# EAGLE design lul (EAGLE 9.5.1)
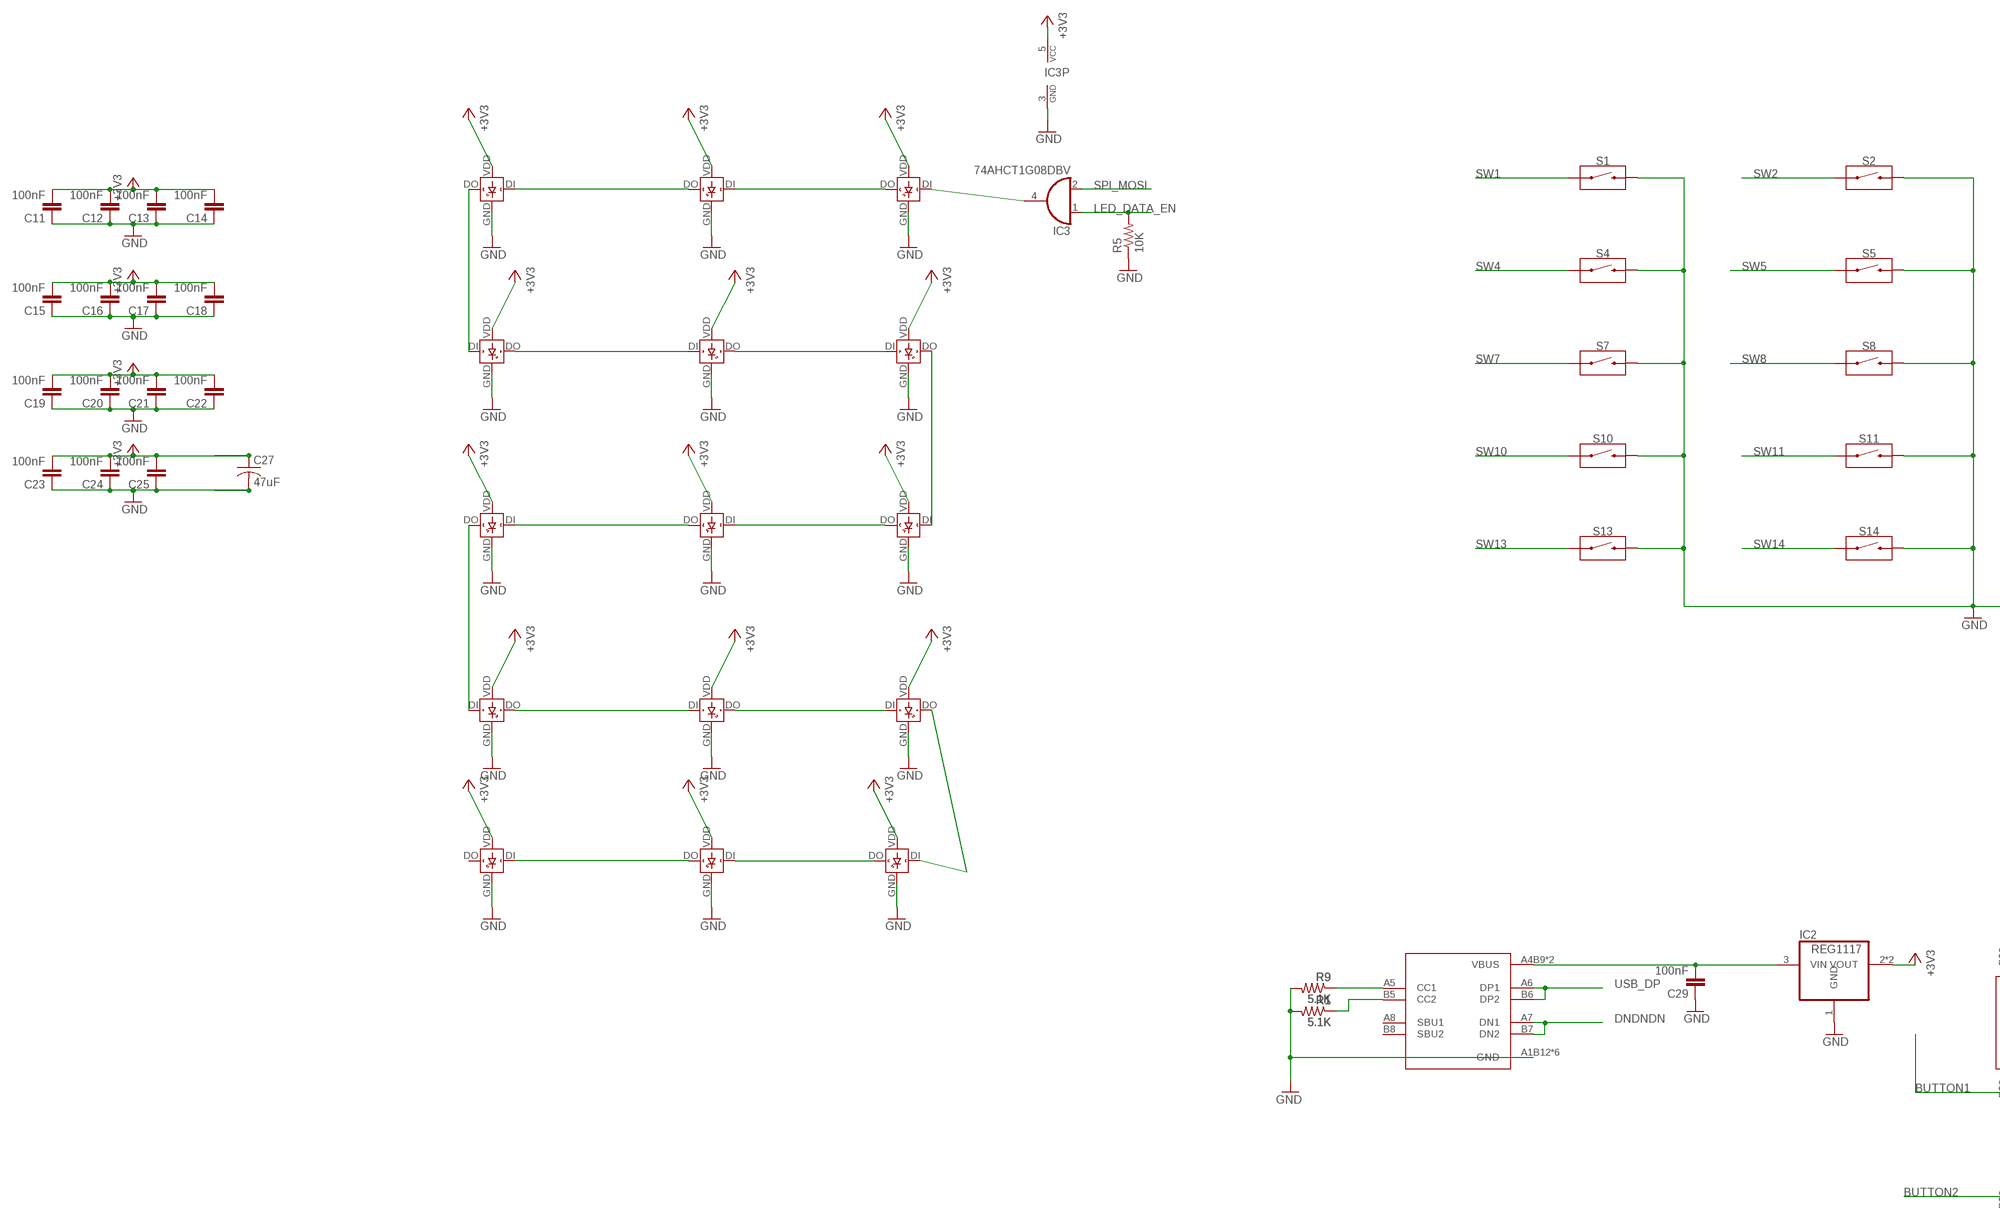
[diagram p0: schematic, sheet 1, part 1 of 2]
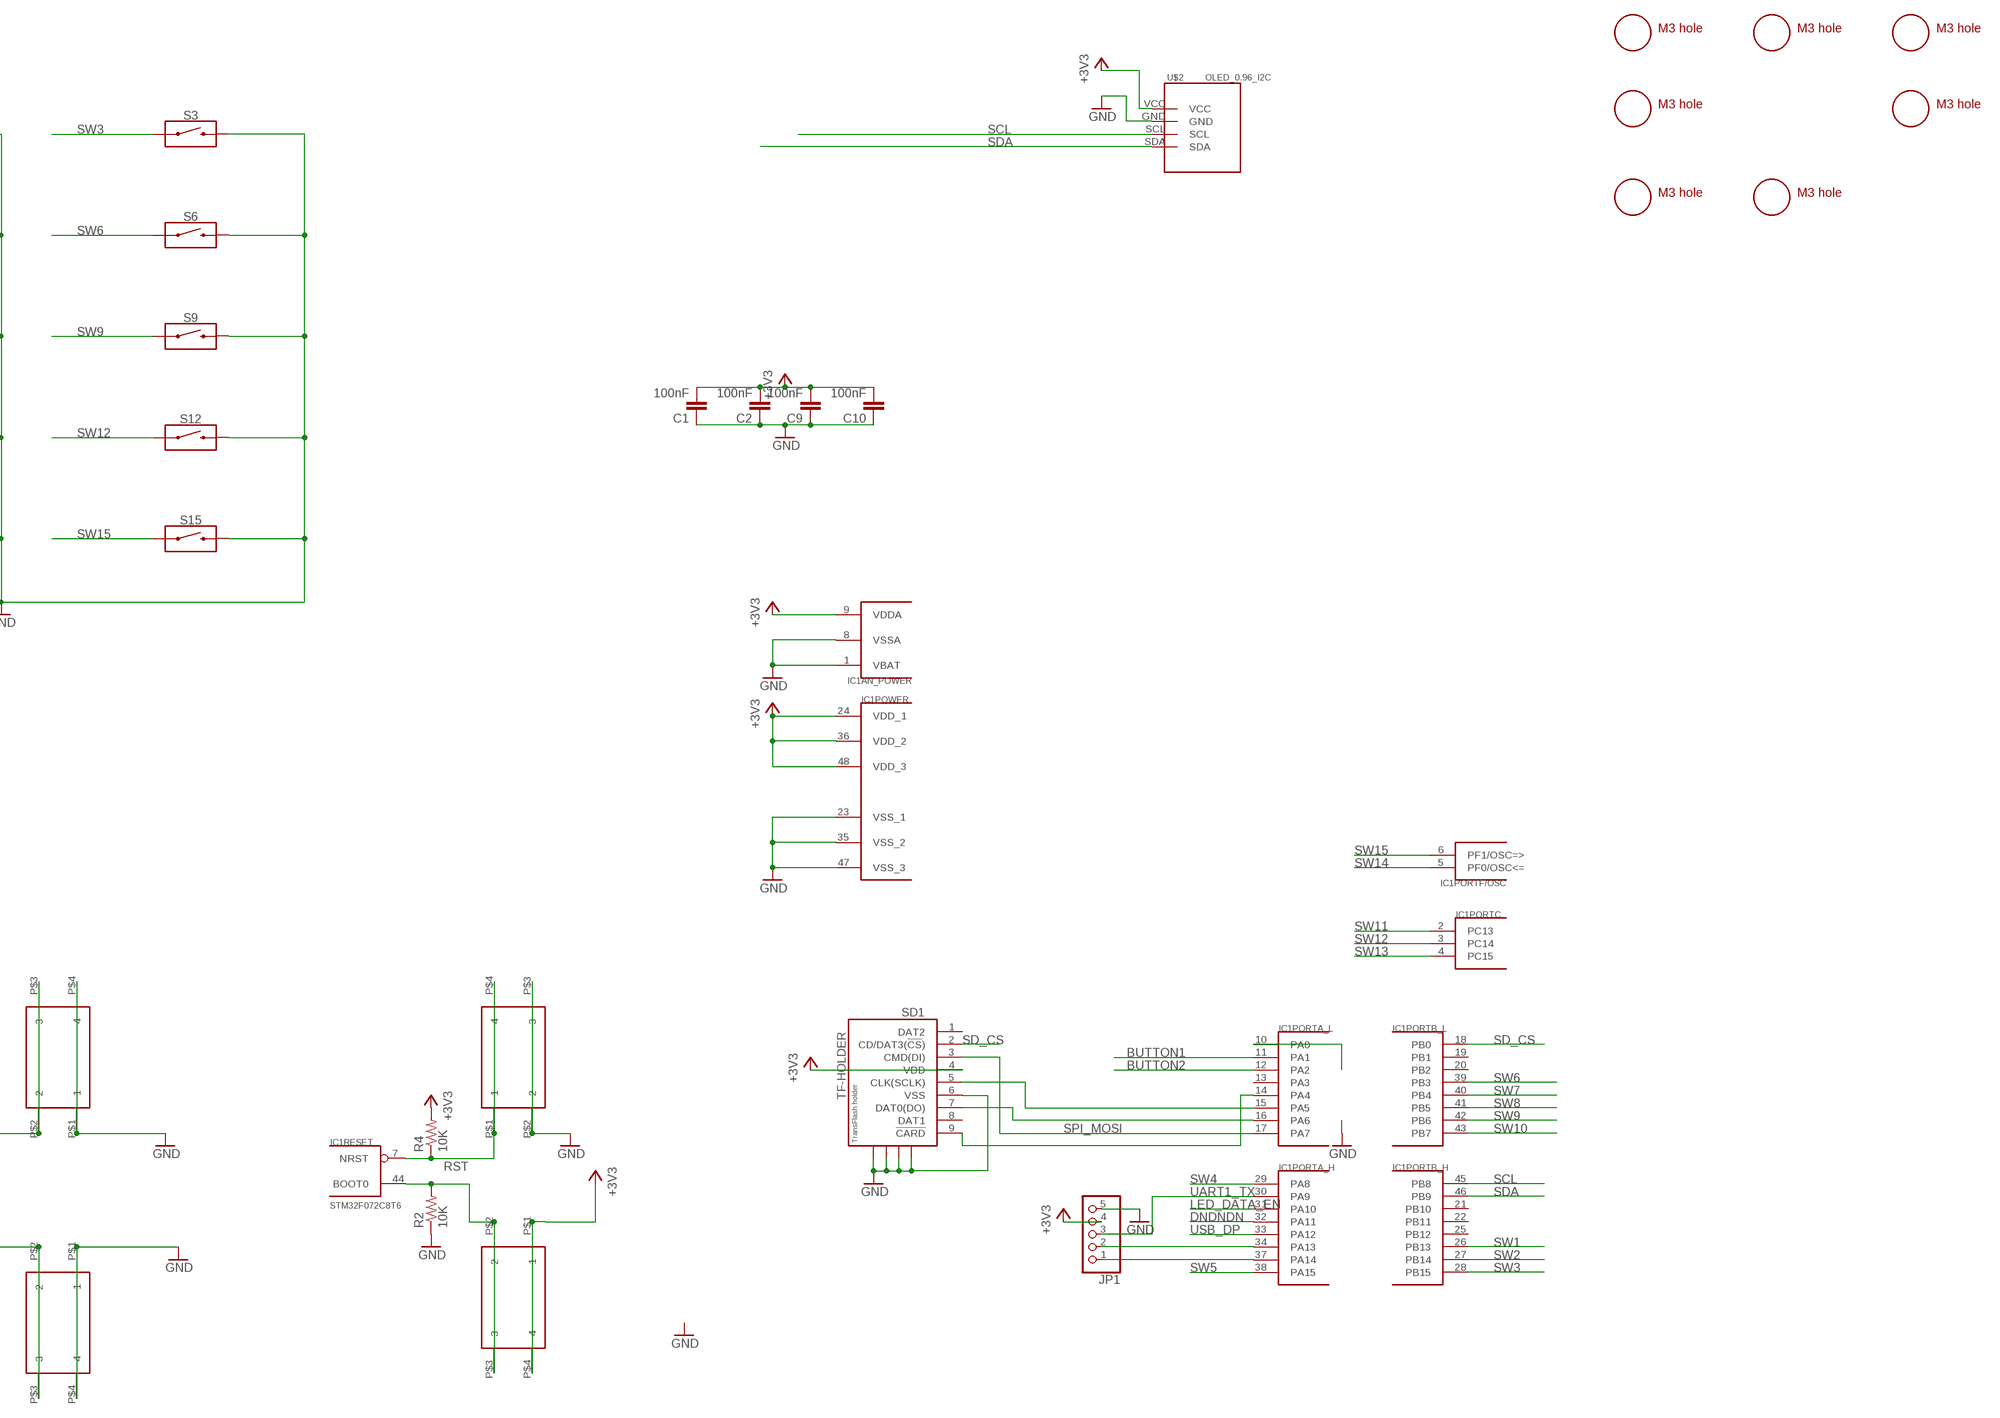
[diagram p1: schematic, sheet 1, part 2 of 2]

## Parts
C1  100nF  CAP0805  [0805@1]
C2  100nF  CAP0805  [0805@1]
C9  100nF  CAP0805  [0805@1]
C10  100nF  CAP0805  [0805@1]
C11  100nF  CAP0805  [0805@1]
C12  100nF  CAP0805  [0805@1]
C13  100nF  CAP0805  [0805@1]
C14  100nF  CAP0805  [0805@1]
C15  100nF  CAP0805  [0805@1]
C16  100nF  CAP0805  [0805@1]
C17  100nF  CAP0805  [0805@1]
C18  100nF  CAP0805  [0805@1]
C19  100nF  CAP0805  [0805@1]
C20  100nF  CAP0805  [0805@1]
C21  100nF  CAP0805  [0805@1]
C22  100nF  CAP0805  [0805@1]
C23  100nF  CAP0805  [0805@1]
C24  100nF  CAP0805  [0805@1]
C25  100nF  CAP0805  [0805@1]
C27  47uF  C-USC1210  [C1210]
C29  100nF  CAP0805  [0805@1]
IC1  STM32F072C8T6  [TQFP48]
IC2  REG1117  [SOT223]
IC3  74AHCT1G08DBV  [SOT23-5]
JP1  PINHD-1X5  [1X05]
LED1  WS2812B-MINI  [WS2812B-MINI]
LED2  WS2812B-MINI  [WS2812B-MINI]
LED3  WS2812B-MINI  [WS2812B-MINI]
LED4  WS2812B-MINI  [WS2812B-MINI]
LED5  WS2812B-MINI  [WS2812B-MINI]
LED6  WS2812B-MINI  [WS2812B-MINI]
LED7  WS2812B-MINI  [WS2812B-MINI]
LED8  WS2812B-MINI  [WS2812B-MINI]
LED9  WS2812B-MINI  [WS2812B-MINI]
LED10  WS2812B-MINI  [WS2812B-MINI]
LED11  WS2812B-MINI  [WS2812B-MINI]
LED12  WS2812B-MINI  [WS2812B-MINI]
LED13  WS2812B-MINI  [WS2812B-MINI]
LED14  WS2812B-MINI  [WS2812B-MINI]
LED15  WS2812B-MINI  [WS2812B-MINI]
R1  5.1K  RESISTOR0805-RES  [0805]
R2  10K  RESISTOR0805-RES  [0805]
R4  10K  RESISTOR0805-RES  [0805]
R5  10K  RESISTOR0805-RES  [0805]
R9  5.1K  RESISTOR0805-RES  [0805]
S1  CHERRY-MX-LED  [CHERRY-MX-LED]
S2  CHERRY-MX-LED  [CHERRY-MX-LED]
S3  CHERRY-MX-LED  [CHERRY-MX-LED]
S4  CHERRY-MX-LED  [CHERRY-MX-LED]
S5  CHERRY-MX-LED  [CHERRY-MX-LED]
S6  CHERRY-MX-LED  [CHERRY-MX-LED]
S7  CHERRY-MX-LED  [CHERRY-MX-LED]
S8  CHERRY-MX-LED  [CHERRY-MX-LED]
S9  CHERRY-MX-LED  [CHERRY-MX-LED]
S10  CHERRY-MX-LED  [CHERRY-MX-LED]
S11  CHERRY-MX-LED  [CHERRY-MX-LED]
S12  CHERRY-MX-LED  [CHERRY-MX-LED]
S13  CHERRY-MX-LED  [CHERRY-MX-LED]
S14  CHERRY-MX-LED  [CHERRY-MX-LED]
S15  CHERRY-MX-LED  [CHERRY-MX-LED]
SD1  TF-HOLDER  [TF-PULL]
SW1  324_SW324_SWITCH_FOOT_HOLE  [342_SWICH_FOOT_HOLE]
SW2  324_SW324_SWITCH_FOOT_HOLE  [342_SWICH_FOOT_HOLE]
SW3  324_SW324_SWITCH_FOOT_HOLE  [342_SWICH_FOOT_HOLE]
SW4  324_SW324_SWITCH_FOOT_HOLE  [342_SWICH_FOOT_HOLE]
U2  USBC_16P  [USBC_16P_FOOT]
U$2  OLED_0.96_I2C  [OLED_0.96_I2C]
U$7  M3_MOUNTING_HOLE  [M3_MOUNTING_HOLE_PACK]
U$9  M3_MOUNTING_HOLE  [M3_MOUNTING_HOLE_PACK]
U$10  M3_MOUNTING_HOLE  [M3_MOUNTING_HOLE_PACK]
U$11  M3_MOUNTING_HOLE  [M3_MOUNTING_HOLE_PACK]
U$14  M3_MOUNTING_HOLE  [M3_MOUNTING_HOLE_PACK]
U$15  M3_MOUNTING_HOLE  [M3_MOUNTING_HOLE_PACK]
U$16  M3_MOUNTING_HOLE  [M3_MOUNTING_HOLE_PACK]

## Nets
+3V3: C1.2 C2.2 C9.2 C10.2 C11.2 C12.2 C13.2 C14.2 C15.2 C16.2 C17.2 C18.2 C19.2 C20.2 C21.2 C22.2 C23.2 C24.2 C25.2 C27.1 IC1.9(AN_POWER:VDDA) IC1.24(POWER:VDD_1) IC1.36(POWER:VDD_2) IC1.48(POWER:VDD_3) IC2.2(VOUT) IC2.4(VOUT) IC3.5(VCC) JP1.4 LED1.VDD LED2.VDD LED3.VDD LED4.VDD LED5.VDD LED6.VDD LED7.VDD LED8.VDD LED9.VDD LED10.VDD LED11.VDD LED12.VDD LED13.VDD LED14.VDD LED15.VDD R4.2 SD1.4(VDD) SW1.P$1 SW1.P$4 U$2.VCC
BUTTON1: IC1.11(PORTA_L:PA1) SW3.P$2 SW3.P$3
BUTTON2: IC1.12(PORTA_L:PA2) SW4.P$2 SW4.P$3
DNDNDN: IC1.32(PORTA_H:PA11) U2.A7(DN1) U2.B7(DN2)
GND: C1.1 C2.1 C9.1 C10.1 C11.1 C12.1 C13.1 C14.1 C15.1 C16.1 C17.1 C18.1 C19.1 C20.1 C21.1 C22.1 C23.1 C24.1 C25.1 C27.2 C29.1 IC1.1(AN_POWER:VBAT) IC1.8(AN_POWER:VSSA) IC1.23(POWER:VSS_1) IC1.35(POWER:VSS_2) IC1.47(POWER:VSS_3) IC2.1(GND) IC3.3(GND) JP1.5 LED1.GND LED2.GND LED3.GND LED4.GND LED5.GND LED6.GND LED7.GND LED8.GND LED9.GND LED10.GND LED11.GND LED12.GND LED13.GND LED14.GND LED15.GND R1.2 R2.1 R5.1 R9.2 S1.S2 S2.S2 S3.S2 S4.S2 S5.S2 S6.S2 S7.S2 S8.S2 S9.S2 S10.S2 S11.S2 S12.S2 S13.S2 S14.S2 S15.S2 SD1.6(VSS) SD1.S1 SD1.S2 SD1.S3 SD1.S4 SW2.P$2 SW2.P$3 SW3.P$1 SW3.P$4 SW4.P$1 SW4.P$4 U2.A1B12(GND) U2.B11A12(GND) U2.P$13(GND) U2.P$14(GND) U2.P$15(GND) U2.P$16(GND) U$2.GND
LED_DATA_EN: IC1.31(PORTA_H:PA10) IC3.1(I0) R5.2
N$1: C29.2 IC2.3(VIN) U2.A4B9(VBUS) U2.B4A9(VBUS)
N$2: IC1.44(RESET:BOOT0) R2.2 SW1.P$2 SW1.P$3
N$8: IC1.15(PORTA_L:PA5) SD1.5(CLK(SCLK))
N$9: LED2.DI(DIN) LED3.DO(DOUT)
N$10: IC1.16(PORTA_L:PA6) SD1.7(DAT0(DO))
N$14: IC1.14(PORTA_L:PA4) SD1.9(!CARD)
N$15: LED1.DI(DIN) LED2.DO(DOUT)
N$17: LED1.DO(DOUT) LED4.DI(DIN)
N$18: LED4.DO(DOUT) LED5.DI(DIN)
N$19: LED5.DO(DOUT) LED6.DI(DIN)
N$20: LED6.DO(DOUT) LED9.DI(DIN)
N$21: LED8.DI(DIN) LED9.DO(DOUT)
N$22: LED7.DI(DIN) LED8.DO(DOUT)
N$23: LED7.DO(DOUT) LED10.DI(DIN)
N$24: LED10.DO(DOUT) LED11.DI(DIN)
N$25: LED11.DO(DOUT) LED12.DI(DIN)
N$26: LED12.DO(DOUT) LED15.DI(DIN)
N$27: LED14.DI(DIN) LED15.DO(DOUT)
N$28: LED13.DI(DIN) LED14.DO(DOUT)
N$29: IC3.4(O) LED3.DI(DIN)
N$31: R1.1 U2.B5(CC2)
N$32: IC1.37(PORTA_H:PA14) JP1.1
N$33: R9.1 U2.A5(CC1)
N$34: IC1.34(PORTA_H:PA13) JP1.2
OLED_RESET: IC1.10(PORTA_L:PA0)
RST: IC1.7(RESET:NRST) R4.1 SW2.P$1 SW2.P$4
SCL: IC1.45(PORTB_H:PB8) U$2.SCL
SD_CS: IC1.18(PORTB_L:PB0) SD1.2(CD/DAT3(!CS!))
SDA: IC1.46(PORTB_H:PB9) U$2.SDA
SPI_MOSI: IC1.17(PORTA_L:PA7) IC3.2(I1) SD1.3(CMD(DI))
SW1: IC1.26(PORTB_H:PB13) S1.S1
SW2: IC1.27(PORTB_H:PB14) S2.S1
SW3: IC1.28(PORTB_H:PB15) S3.S1
SW4: IC1.29(PORTA_H:PA8) S4.S1
SW5: IC1.38(PORTA_H:PA15) S5.S1
SW6: IC1.39(PORTB_L:PB3) S6.S1
SW7: IC1.40(PORTB_L:PB4) S7.S1
SW8: IC1.41(PORTB_L:PB5) S8.S1
SW9: IC1.42(PORTB_L:PB6) S9.S1
SW10: IC1.43(PORTB_L:PB7) S10.S1
SW11: IC1.2(PORTC:PC13) S11.S1
SW12: IC1.3(PORTC:PC14) S12.S1
SW13: IC1.4(PORTC:PC15) S13.S1
SW14: IC1.5(PORTF/OSC:PF0/OSC<=) S14.S1
SW15: IC1.6(PORTF/OSC:PF1/OSC=>) S15.S1
UART1_TX: IC1.30(PORTA_H:PA9) JP1.3
USB_DP: IC1.33(PORTA_H:PA12) U2.A6(DP1) U2.B6(DP2)
Unconnected: IC1.13(PORTA_L:PA3) IC1.19(PORTB_L:PB1) IC1.20(PORTB_L:PB2) IC1.21(PORTB_H:PB10) IC1.22(PORTB_H:PB11) IC1.25(PORTB_H:PB12) LED13.DO(DOUT) SD1.1(DAT2) SD1.8(DAT1) U2.A8(SBU1) U2.B8(SBU2)

## Library data of the parts
C1 C2 C9-C25 C29 = clock:CAP: Capacitor Standard 0603 ceramic capacitor, and 0.1" leaded capacitor.
C27 = clock:C-US: CAPACITOR, American symbol
IC1 = clock:STM32F072C8T6: ST STM32F072 48pin LQFP
IC2 = clock:REG1117: 800mA and 1A Low Dropout (LDO) Positive Regulator 1.8V, 2.5V, 2.85V, 3.3V, 5V, and Adj; MPN: REG1117; OC_FARNELL: 1097566; OC_NEWARK: 14P6981
IC3 = 74xx-little-de:74*1G08: 2-input AND gate
JP1 = pinhead:PINHD-1X5: PIN HEADER
LED1-LED15 = LED:WS2812B
R1 R9 = joyAnalog:RESISTOR: Resistor Basic schematic elements and footprints for 0603, 1206, and PTH resistors.
R2 R4 R5 = clock:RESISTOR: Resistor Basic schematic elements and footprints for 0603, 1206, and PTH resistors.
S1-S15 = SparkFun-Cherry-MX-Switch-Breakout:CHERRY-MX-LED
SD1 = clock:TF-HOLDER: TF / Micro SD socket is PUSH-PUSH type, the card can be pushed into and auto locked and pushed out by simply press the card. Surface Mounting type.
SW1-SW4 = 3pos_slide_switch:324_SW
U2 = my_usbc_16p:USBC_16P
U$2 = tft_1.8_1.44_oled_0.96:OLED_0.96_I2C
U$7 U$9-U$11 U$14-U$16 = clock:M3_MOUNTING_HOLE

## Board
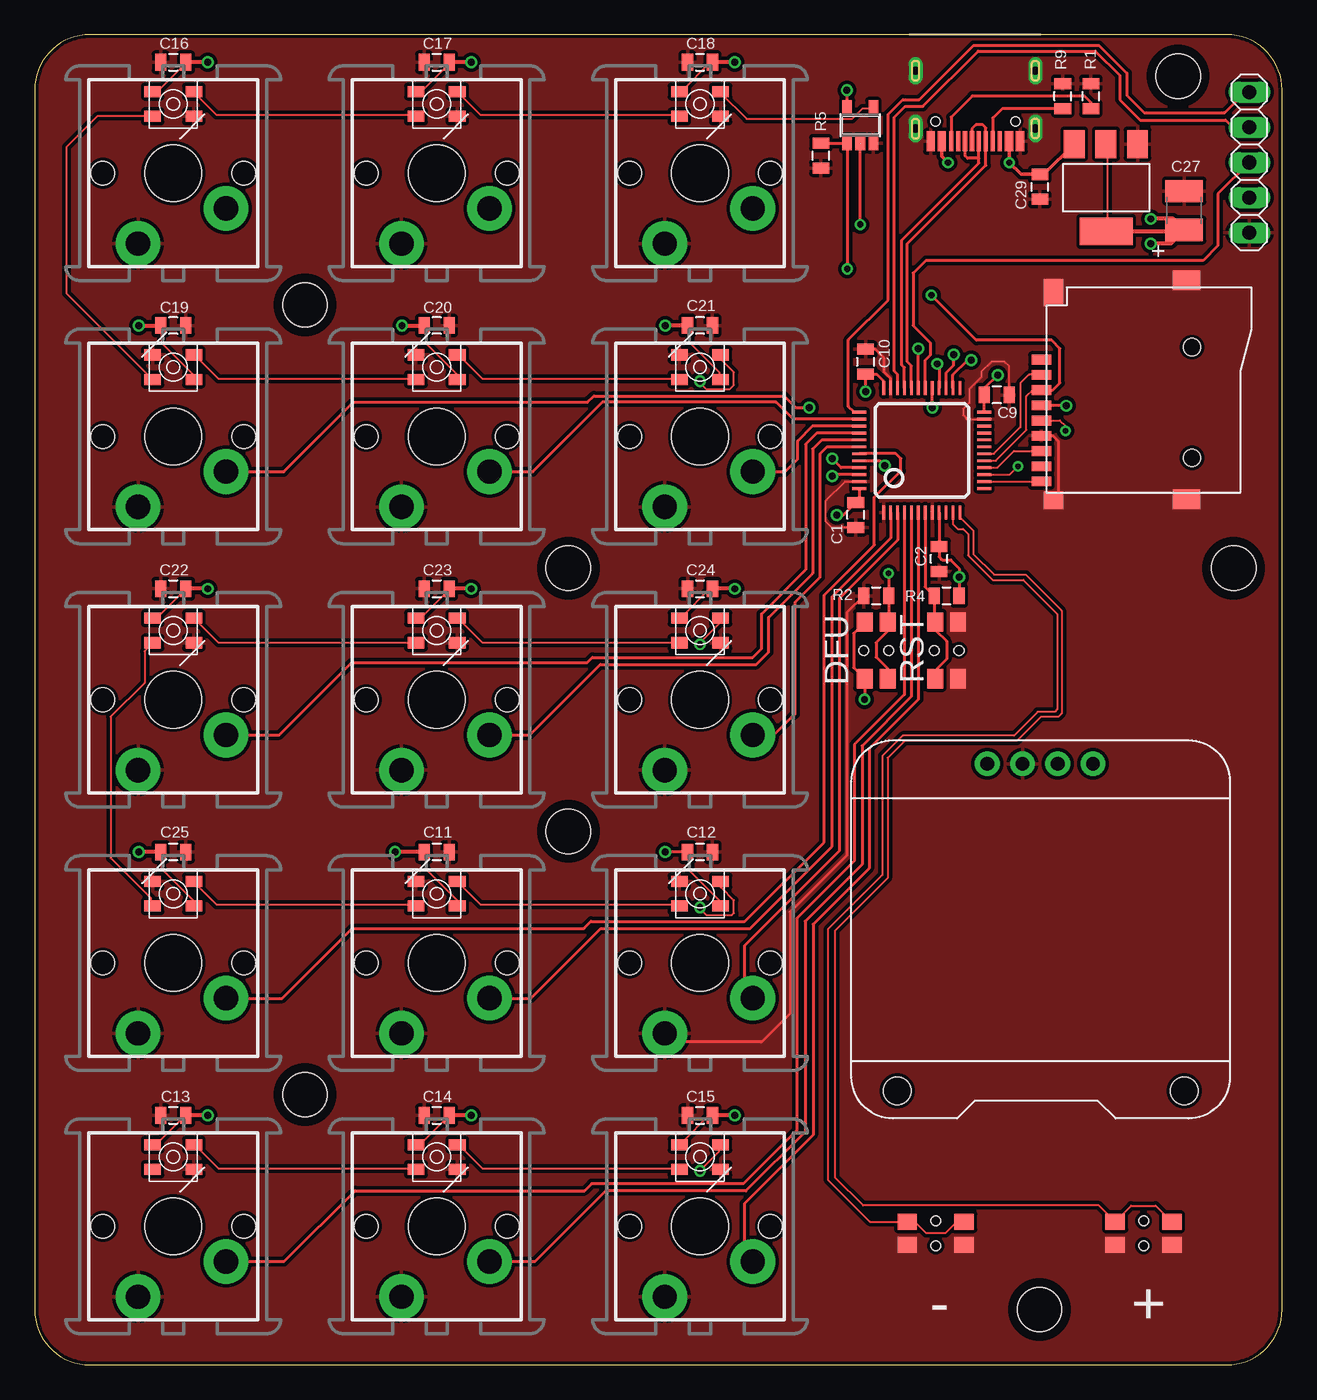
[diagram p2: board, top side]
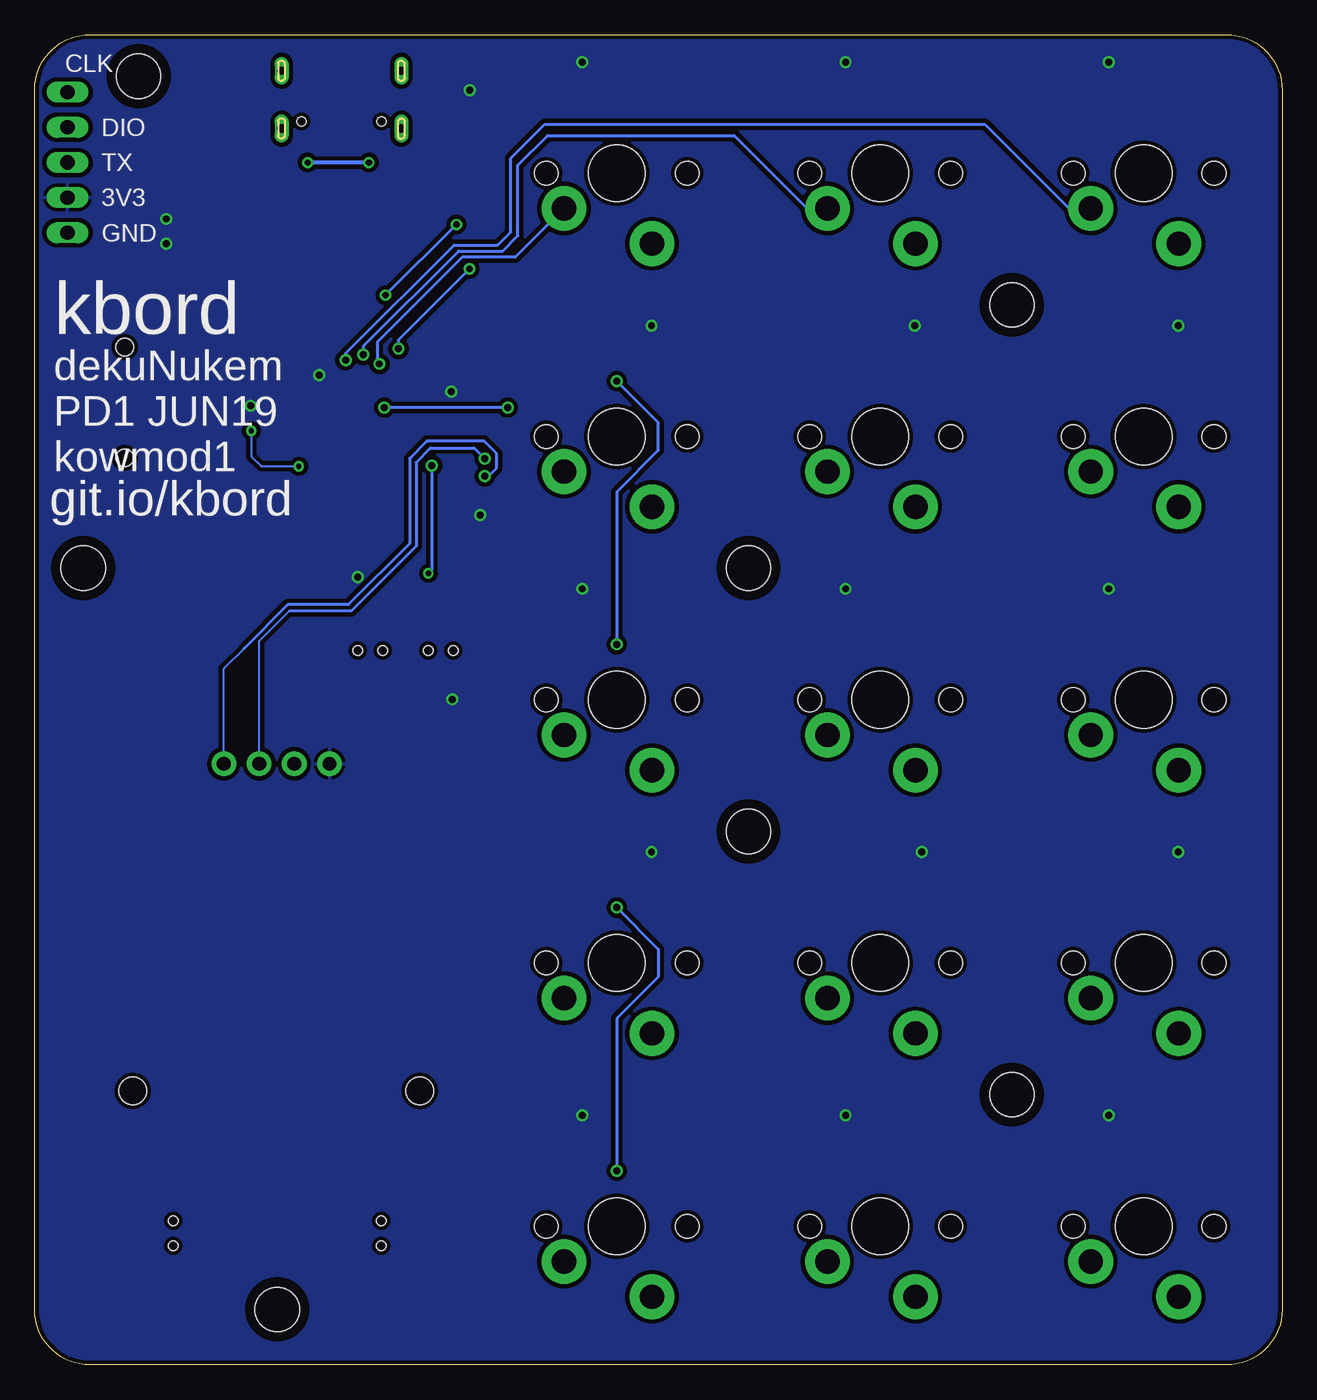
[diagram p3: board, bottom side, seen from below]

Size 90 x 96 mm. Coordinates in mm from the lower left corner, seen from the top.
Outline: 0,92 0,4 arc90 4,0 86,0 arc90 90,4 90,92 arc90 86,96 4,96 arc90 0,92
Copper layers (1*16): Top 0.035mm / dielectric 1.5mm / Bottom 0.035mm
Design rules "deku_2layer_6mil": minimum track width 6mil, minimum drill 15mil, track to track 6mil, track to pad 6mil, pad to pad 6mil, via to via 6mil, smd to smd 6mil, copper to edge 10mil, drill to drill 6mil, minimum pad ring 7mil, minimum via ring 7mil, stop-mask expansion 4mil, vias tented up to drill 25mil, thermal gap 10mil

### Footprints (pad centres in the part's own frame; a part is rotated, then mirrored left to right if it is on the bottom)
0805@1 = smd 0.8 x 1.2: 1 -0.9,0; 2 0.9,0
C1210 = smd 1.6 x 2.7: 1 -1.4,0; 2 1.4,0
TQFP48 = smd 0.2 x 1: 1 -2.75,-4.5; 2 -2.25,-4.5; 3 -1.75,-4.5; 4 -1.25,-4.5; 5 -0.75,-4.5; 6 -0.25,-4.5; 7 0.25,-4.5; 8 0.75,-4.5; 9 1.25,-4.5; 10 1.75,-4.5; 11 2.25,-4.5; 12 2.75,-4.5; 25 2.75,4.5; 26 2.25,4.5; 27 1.75,4.5; 28 1.25,4.5; 29 0.75,4.5; 30 0.25,4.5; 31 -0.25,4.5; 32 -0.75,4.5; 33 -1.25,4.5; 34 -1.75,4.5; 35 -2.25,4.5; 36 -2.75,4.5 | smd 1 x 0.2: 13 4.5,-2.75; 14 4.5,-2.25; 15 4.5,-1.75; 16 4.5,-1.25; 17 4.5,-0.75; 18 4.5,-0.25; 19 4.5,0.25; 20 4.5,0.75; 21 4.5,1.25; 22 4.5,1.75; 23 4.5,2.25; 24 4.5,2.75; 37 -4.5,2.75; 38 -4.5,2.25; 39 -4.5,1.75; 40 -4.5,1.25; 41 -4.5,0.75; 42 -4.5,0.25; 43 -4.5,-0.25; 44 -4.5,-0.75; 45 -4.5,-1.25; 46 -4.5,-1.75; 47 -4.5,-2.25; 48 -4.5,-2.75
SOT223 = smd 1.499 x 2.007: 1 -2.261,-3.15; 2 0.025,-3.15; 3 2.311,-3.15 | smd 3.81 x 2.007: 4 0,3.15
SOT23-5 = smd 0.69 x 0.99: 1 -0.95,-1.29; 2 0,-1.29; 3 0.95,-1.29; 4 0.95,1.3; 5 -0.95,1.3
1X05 = drill 1.016 long: 1 -5.08,0; 2 -2.54,0; 3 0,0; 4 2.54,0; 5 5.08,0
WS2812B-MINI = smd 0.8 x 1.2: DI 0.89,-1.49; DO -0.89,1.49; GND -0.89,-1.49; VDD 0.89,1.49
0805 = smd 0.8 x 1.2: 1 -0.9,0; 2 0.9,0
CHERRY-MX-LED = drill 1.753 pad 3.226: S1 -3.81,2.54; S2 2.54,5.08 | hole 4.089: 0,0 | hole 1.707: -5.08,0; 5.08,0
TF-PULL = smd 0.7 x 1.4: 1 -2.2,-7.62; 2 -1.1,-7.62; 3 0,-7.62; 4 1.1,-7.62; 5 2.2,-7.62; 6 3.3,-7.62; 7 4.4,-7.62; 8 5.5,-7.62; 9 6.6,-7.62 | smd 1.4 x 2: S1 -7.9,2.85; S2 7.9,2.85 | smd 1.28 x 1.4: S3 7.96,-6.75 | smd 1.95 x 1.4: S4 -7.025,-6.75 | hole 1.25: -3.1,3.25; 4.9,3.25
342_SWICH_FOOT_HOLE = smd 1.4 x 1.15: P$1 -2.05,-0.825; P$2 -2.05,0.825; P$3 2.05,0.825; P$4 2.05,-0.825 | hole 0.7: 0,0.9; 0,-0.9
USBC_16P_FOOT = smd 0.6 x 1.45: A1B12 -3.225,3.848; A4B9 -2.425,3.848; B4A9 2.425,3.848; B11A12 3.225,3.848 | smd 0.3 x 1.45: A5 -1.25,3.848; A6 -0.25,3.848; A7 0.25,3.848; A8 1.25,3.848; B5 1.75,3.848; B6 0.75,3.848; B7 -0.75,3.848; B8 -1.75,3.848 | drill 0.6 pad 1 long: P$13 -4.32,2.933; P$14 4.32,2.933; P$15 -4.32,-1.248; P$16 4.32,-1.248 | hole 0.65: -2.89,2.402; 2.89,2.402
OLED_0.96_I2C = drill 1 pad 1.778: GND -1.63,11.63; SCL 0.91,11.63; SDA 3.45,11.63; VCC -4.17,11.63 | hole 2: -10.67,-11.97; 10.03,-11.97
M3_MOUNTING_HOLE_PACK = hole 3.2: 0,0

### Placement (x,y rotation side)
C1  59.23,61.34 90 top
C2  65.25,58.17 90 top
C9  69.42,70 180 top
C10  59.94,72.39 270 top
C11  29,37.01 180 top
C12  48,37.01 180 top
C13  10,18.01 0 top
C14  29,18.01 0 top
C15  48,18.01 0 top
C16  10,94.01 0 top
C17  29,94.01 0 top
C18  48,94.01 0 top
C19  10,75.01 180 top
C20  29,75.01 180 top
C21  48,75.01 180 top
C22  10,56.01 0 top
C23  29,56.01 0 top
C24  48,56.01 0 top
C25  10,37.01 180 top
C27  82.93,83.31 90 top
C29  72.52,85.01 90 top
IC1  64,66 0 top
IC2  77.31,84.95 180 top
IC3  59.56,89.46 0 top
JP1  87.63,86.77 270 top
LED1  10,91 90 top
LED2  29,91 90 top
LED3  48,91 90 top
LED4  10,72 270 top
LED5  29,72 270 top
LED6  48,72 270 top
LED7  10,53 90 top
LED8  29,53 90 top
LED9  48,53 90 top
LED10  10,34 270 top
LED11  29,34 270 top
LED12  48,34 270 top
LED13  10,15 90 top
LED14  29,15 90 top
LED15  48,15 90 top
R1  76.2,91.57 90 top
R2  60.71,55.5 0 top
R4  65.79,55.5 0 top
R5  56.72,87.27 90 top
R9  74.17,91.57 90 top
S1  10,86 180 top
S2  29,86 180 top
S3  48,86 180 top
S4  10,67 180 top
S5  29,67 180 top
S6  48,67 180 top
S7  10,48 180 top
S8  29,48 180 top
S9  48,48 180 top
S10  10,29 180 top
S11  29,29 180 top
S12  48,29 180 top
S13  10,10 180 top
S14  29,10 180 top
S15  48,10 180 top
SD1  80.25,70.35 270 top
SW1  60.71,51.56 270 top
SW2  65.79,51.56 270 top
SW3  65,9.5 0 top
SW4  80,9.5 0 top
U2  67.87,92.15 180 top
U$2  72.9,31.75 0 top
U$7  19.5,19.5 0 top
U$9  86.5,57.5 0 top
U$10  82.5,93 0 top
U$11  19.5,76.5 0 top
U$14  72.5,4 0 top
U$15  38.5,57.5 0 top
U$16  38.5,38.5 0 top

### Tracks (layer width: path | path; a pad name or v marks a point on that pad's centre or on a via)
+3V3  (via drill 0.5)
  Top 0.152: LED13.VDD 8.53,16 8.84,16 10.82,17.98 C13.2 | LED14.VDD 27.58,16 27.89,16 29.87,17.98 C14.2 | LED15.VDD 46.63,16 48.77,18.14 C15.2 | LED7.VDD 8.53,53.95 8.84,53.95 10.82,55.93 C22.2 | LED11.VDD 30.48,33.22 30.48,33.53 28.19,35.81 28.19,36.88 C11.2 | LED8.VDD 27.58,53.95 27.89,53.95 29.87,55.93 C23.2 | LED9.VDD 46.63,53.95 48.77,56.08 C24.2 | LED5.VDD 30.48,71.17 30.48,71.48 28.19,73.76 28.19,74.98 C20.2 | LED1.VDD 8.53,91.9 8.84,91.9 10.82,93.88 C16.2 | LED6.VDD 49.38,71.17 49.38,71.63 47.24,73.76 47.24,74.98 C21.2 | LED2.VDD 27.58,91.9 27.89,91.9 29.87,93.88 C17.2 | LED3.VDD 46.63,91.9 48.77,94.03 C18.2 | IC2.2 77.42,88.09 77.42,81.84 IC2.4 | LED10.VDD 11.43,33.22 11.43,33.53 9.14,35.81 9.14,36.88 C25.2 | LED12.VDD 49.38,33.22 49.38,33.53 47.24,35.66 47.24,36.88 C12.2 | C19.2 9.14,74.98 9.14,73.76 11.43,71.48 11.43,71.17 LED4.VDD
  Top 0.203: v59.94,70.23 C10.2 60.77,71.49 61.25,71.01 IC1.36 | SD1.4 74.38,69.25 v74.42,69.22 | C12.2 v45.5,37.01 | IC3.5 58.61,91.99 v58.6,92 | v69.47,71.42 68.52,70.47 C9.2 68.5,69.98 IC1.24 | v57.86,61.34 58.33,61.34 C1.2 59.5,62.51 IC1.48 | SW1.P$1 59.88,53.58 59.08,52.78 59.08,50.32 SW1.P$4 59.88,48.05 v59.87,48.03 | IC1.9 C2.2 65.25,58.32 65.48,58.09 66.09,58.09 66.7,57.48 v66.7,56.84 66.7,55.51 R4.2
  Top 0.305: v12.5,18.01 C13.2 | v31.5,18.01 C14.2 | v50.5,18.01 C15.2 | v7.5,75.01 C19.2 | v26.5,75.01 C20.2 | C21.2 v45.5,75.01 | C25.2 v7.5,37.01 | C11.2 v26,37.01 | v12.5,94.01 C16.2 | v31.5,94.01 C17.2 | v50.5,94.01 C18.2 | v12.5,56.01 C22.2 | v31.5,56.01 C23.2 | v50.5,56.01 C24.2 | IC2.4 82.82,81.81 | 82.82,81.81 C27.1 82.14,82.7 v80.52,82.7 | v80.52,80.92 81.94,80.92 82.82,81.81
  pour Bottom (isolate 0.305): 0,96.01 0,0 90.04,0 90.04,96.01
BUTTON1
  Top 0.152: IC1.11 66.25,60.67 66.6,60.33 66.98,60.33 67.33,59.97 67.33,58.42 69.11,56.64 71.32,56.64 73.79,54.18 73.79,47.32 73.58,47.12 72.36,47.12 70.66,45.41 62.64,45.41 61.16,43.94 61.16,35.36 57.23,31.42 57.23,13.36 60.26,10.32 SW3.P$2 63.49,10.32 64.29,9.53 65.72,9.53 66.52,10.32 SW3.P$3
BUTTON2
  Top 0.152: IC1.12 66.75,61.17 67.72,60.2 67.72,58.52 69.22,57.02 71.5,57.02 74.09,54.43 74.09,47.02 73.84,46.76 72.59,46.76 70.87,45.03 62.76,45.03 61.54,43.81 61.54,35.13 57.73,31.32 57.73,13.54 59.77,11.51 76.77,11.51 SW4.P$2 79.11,11.48 80.87,11.48 82.03,10.32 SW4.P$3
DNDNDN
  Top 0.203: IC1.32 63.25,72.11 62.94,72.42 62.94,80.9 68.62,86.58 U2.B7 68.62,89.27 68.4,89.48 67.89,89.48 67.62,89.21 U2.A7
GND
  Top 0.152: IC1.23 67.26,68.25 66.98,68.53 66.98,68.99 67.44,69.44 67.44,70.43 68.3,71.3 68.3,71.68 69.04,72.42 69.95,72.42 70.31,72.06 70.31,70.01 C9.1 | C1.1 57.49,60.44 57.07,60.86 57.07,62.36 58.47,63.75 IC1.47 | C2.1 65.38,57.15 65.35,57.17 | 8.53,73 LED4.GND
  Top 0.203: IC1.35 61.75,71.19 61.29,71.65 61.29,72.64 60.64,73.29 C10.1 | SD1.6 73.46,67.05 73.86,66.65 73.86,62.76 SD1.S3 | R2.1 58.6,54.29 58.6,36.78 54.51,32.69 54.51,25.35 52.45,23.29 46.09,23.29 S12.S2
  pour Top (isolate 0.254): 0,96 0,0 90,0 90,96
LED_DATA_EN  (via drill 0.45, 0.5)
  Top 0.203: IC1.31 v63.75,73.33 | R5.2 IC3.1 v58.61,79.11 v58.62,79.1
  Bottom 0.203: v58.62,79.1 63.75,73.97 v63.75,73.33
N$1  (via drill 0.45)
  Top 0.254: U2.B4A9 65.44,87.21 v65.89,86.77 | U2.A4B9 70.29,86.81 v70.32,86.78 | v70.31,86.77 71.16,85.91 C29.2 72.8,85.91 IC2.3
  Top 0.305: v70.32,86.78 v70.31,86.77
  Bottom 0.305: v65.89,86.77 v70.31,86.77
N$2  (via drill 0.38, 0.5)
  Top 0.203: IC1.44 60.99,65.25 v61.34,64.9 | v61.59,57.12 61.61,57.11 R2.2 61.61,53.69 SW1.P$2 61.53,52.95 60.71,52.12 60.71,51.08 61.53,50.25 SW1.P$3
  Bottom 0.203: v61.34,64.9 61.34,57.38 v61.59,57.12
N$8  (via drill 0.38)
  Top 0.152: IC1.15 70.35,64.25 v70.94,64.85 | SD1.5 73.96,68.15 74.37,67.74 v74.37,67.41
  Bottom 0.152: v74.37,67.41 74.37,65.56 73.66,64.85 v70.94,64.85
N$9
  Top 0.152: LED3.DO 46.48,90.22 32.16,90.22 30.63,91.75 LED2.DI
N$10
  Top 0.152: IC1.16 69.45,64.75 70.65,65.95 SD1.7
N$14
  Top 0.152: IC1.14 SD1.9
  Top 0.203: SD1.9
N$15
  Top 0.152: LED1.DI 11.58,91.75 13.11,90.22 27.43,90.22 LED2.DO
N$17
  Top 0.152: LED1.DO 4.51,90.11 2.29,87.88 2.29,77.33 LED4.DI
N$18
  Top 0.152: LED5.DI 27.43,71.17 13.26,71.17 11.58,72.85 LED4.DO
N$19
  Top 0.152: LED6.DI 46.48,71.17 32.31,71.17 30.63,72.85 LED5.DO
N$20  (via drill 0.5)
  Top 0.152: LED9.DI 49.38,53.8 49.38,53.49 48.01,52.12 v48,52 | LED6.DO 49.53,72.85 49.53,72.54 50.44,71.63 50.44,70.71 50.14,70.41 48.46,70.41 48.01,70.87 v48,71
  Bottom 0.203: v48,52 48,63 45,66 45,68 v48,71
N$21
  Top 0.152: LED9.DO 46.48,52.12 32.31,52.12 30.63,53.8 LED8.DI
N$22
  Top 0.152: LED8.DO 27.43,52.12 13.26,52.12 11.58,53.8 LED7.DI
N$23
  Top 0.152: LED10.DI 8.38,33.22 8.38,33.68 5.49,36.58 5.49,46.79 7.92,49.23 7.92,51.51 8.38,51.97 LED7.DO
N$24
  Top 0.152: LED11.DI 27.43,33.22 13.11,33.22 11.58,34.75 LED10.DO
N$25
  Top 0.152: LED12.DI 46.48,33.22 32.16,33.22 30.63,34.75 LED11.DO
N$26  (via drill 0.5)
  Top 0.152: LED15.DI 49.38,15.85 49.38,15.39 48.01,14.02 v48,14 | LED12.DO 49.53,34.75 49.53,34.44 50.44,33.53 50.44,32.61 50.29,32.46 48.46,32.46 48.01,32.92 v48,33
  Bottom 0.203: v48,33 45,30 45,28 48,25 v48,14
N$27
  Top 0.152: LED15.DO 46.48,14.17 32.31,14.17 30.63,15.85 LED14.DI
N$28
  Top 0.152: LED14.DO 27.43,14.17 13.26,14.17 11.58,15.85 LED13.DI
N$29
  Top 0.152: IC3.4 60.5,90.68 59.74,90.68 58.98,89.92 51.36,89.92 49.53,91.75 LED3.DI
N$31
  Top 0.203: R1.1 76.2,91.11 75.74,91.57 67.64,91.57 66.12,90.05 U2.B5
N$32
  Top 0.203: IC1.37 59.11,68.75 58.7,69.16 58.7,73.98 61.57,76.85 61.57,90.25 62.64,91.31 63.83,91.31 67.74,95.22 76.78,95.22 78.79,93.22 78.79,91.62 80.03,90.37 85.85,90.37 87.33,91.85 JP1.1
N$33
  Top 0.203: R9.1 69.81,90.67 69.12,89.97 U2.A5
N$34
  Top 0.203: IC1.34 62.25,71.48 62.03,71.7 62.03,90.04 62.81,90.83 64.08,90.83 68.07,94.82 76.53,94.82 78.28,93.07 78.28,91.31 79.76,89.84 85.91,89.84 86.44,89.31 JP1.2
RST
  Top 0.203: IC1.7 64.25,56.13 R4.1 64.89,53.69 SW2.P$1 64.96,53.05 65.79,52.22 65.79,50.93 64.96,50.1 SW2.P$4
SCL  (via drill 0.5)
  Top 0.203: v57.53,65.41 58.19,64.75 IC1.45
  Bottom 0.152: U$2.SCL 73.81,52.23 71.63,54.41
  Bottom 0.203: v57.53,65.41 58.29,66.17 61.44,66.17 62.48,65.13 62.48,59.08 67.16,54.41 71.63,54.41
SD_CS
  Top 0.152: IC1.18 69.2,65.75 71.12,67.67 71.12,70.84 71.73,71.45 SD1.2
SDA  (via drill 0.5)
  Top 0.203: IC1.46 57.65,64.25 v57.53,64.14
  Bottom 0.152: U$2.SDA 76.35,50.25 74.89,51.7
  Bottom 0.203: v57.53,64.14 57.25,64.14 56.67,64.72 56.67,65.76 57.56,66.65 61.7,66.65 62.94,65.41 62.94,59.28 67.36,54.86 71.73,54.86 74.89,51.7
SPI_MOSI  (via drill 0.45)
  Top 0.152: IC1.17 69.34,65.25 71.55,67.46 71.55,69.9 72,70.35 SD1.3
  Top 0.203: SD1.3 73.45,70.35 73.97,70.87 73.97,73.36 73.38,73.94 67.94,73.94 v64.69,77.19 | v59.56,82.3 IC3.2
  Bottom 0.203: v64.69,77.19 59.59,82.3 v59.56,82.3
SW1  (via drill 0.5)
  Top 0.203: IC1.26 66.25,71.46 67.31,72.52 v67.56,72.52
  Bottom 0.203: v67.56,72.52 67.56,73 59.74,80.82 56.59,80.82 55.65,81.76 55.65,87.07 53.19,89.53 21.46,89.53 15.39,83.46 S1.S1
SW2  (via drill 0.5)
  Top 0.203: IC1.27 65.75,71.59 66.29,72.14 v66.29,72.9
  Bottom 0.203: v66.29,72.9 66.29,73.51 59.41,80.39 56.24,80.39 55.14,81.48 55.14,86.56 52.98,88.72 39.55,88.72 34.28,83.46 S2.S1
SW3  (via drill 0.5)
  Top 0.203: v65.13,72.24 65.25,72.11 IC1.28
  Bottom 0.203: v65.13,72.24 65.28,72.39 65.28,73.81 59.16,79.93 55.34,79.93 S3.S1
SW4  (via drill 0.5)
  Top 0.203: v64.77,69.09 64.77,70.48 IC1.29 | S4.S1 17.98,64.46 22.99,69.47 39.88,69.47 40.34,69.93 54.08,69.93 54.91,69.09 v55.88,69.09
  Bottom 0.203: v55.88,69.09 v64.77,69.09
SW5
  Top 0.203: S5.S1 35.94,64.46 40.95,69.47 53.49,69.47 54.71,68.25 IC1.38
SW6
  Top 0.203: IC1.39 56.12,67.75 55.04,66.68 55.04,65.35 54.15,64.46 S6.S1
SW7
  Top 0.203: S7.S1 17.65,45.46 22.86,50.67 39.85,50.67 40.23,51.05 51.82,51.05 52.45,51.69 52.45,54.2 55.63,57.38 55.63,66.45 56.43,67.25 IC1.40
SW8
  Top 0.203: S8.S1 35.73,45.46 40.82,50.55 52.07,50.55 52.96,51.44 52.96,53.95 56.13,57.12 56.13,66.09 56.79,66.75 IC1.41
SW9
  Top 0.203: IC1.42 57.16,66.25 56.64,65.73 56.64,56.82 54.84,55.02 54.84,46.97 53.33,45.46 S9.S1
SW10
  Top 0.203: S10.S1 17.88,26.46 22.91,31.5 39.62,31.5 40.13,32 51.23,32 56.95,37.72 56.95,55.55 60.58,59.18 60.58,62.61 62.48,64.52 62.48,65.41 62.14,65.75 IC1.43
SW11
  Top 0.203: IC1.2 61.75,59.67 57.53,55.45 57.53,37.41 51.61,31.5 40.84,31.5 35.81,26.46 S11.S1
SW12
  Top 0.203: IC1.3 62.25,59.53 58.06,55.35 58.06,37.11 51.23,30.27 51.23,27.04 S12.S1
SW13
  Top 0.203: S13.S1 18,7.46 23.11,12.57 39.67,12.57 40.18,13.08 51.13,13.08 54.99,16.94 54.99,32.23 59.13,36.37 59.13,44.76 62.75,48.37 IC1.4
SW14
  Top 0.203: S14.S1 36.11,7.46 41.2,12.55 51.31,12.55 55.58,16.82 55.58,32 59.69,36.12 59.69,44.68 63.25,48.24 IC1.5
SW15
  Top 0.203: IC1.6 63.75,48.03 60.2,44.48 60.2,35.84 56.16,31.8 56.16,16.59 51.2,11.63 51.2,8.07 S15.S1
UART1_TX
  Top 0.203: IC1.30 64.25,72.5 64.64,72.9 64.64,73.74 63.37,75.01 63.37,78.79 64.29,79.7 84.3,79.7 85.37,80.77 85.37,84.51 JP1.3
USB_DP
  Top 0.203: IC1.33 62.75,71.97 62.56,72.16 62.56,81.18 68.12,86.74 68.12,87.07 | 68.12,87.07 U2.A6 | U2.B6 67.12,87.26 67.31,87.07 68.12,87.07

### Text on the board
tNames: DFU | RST | - | +
bNames: CLK | DIO | TX | 3V3 | GND | kbord | dekuNukem / PD1 JUN19 / kowmod1 | git.io/kbord